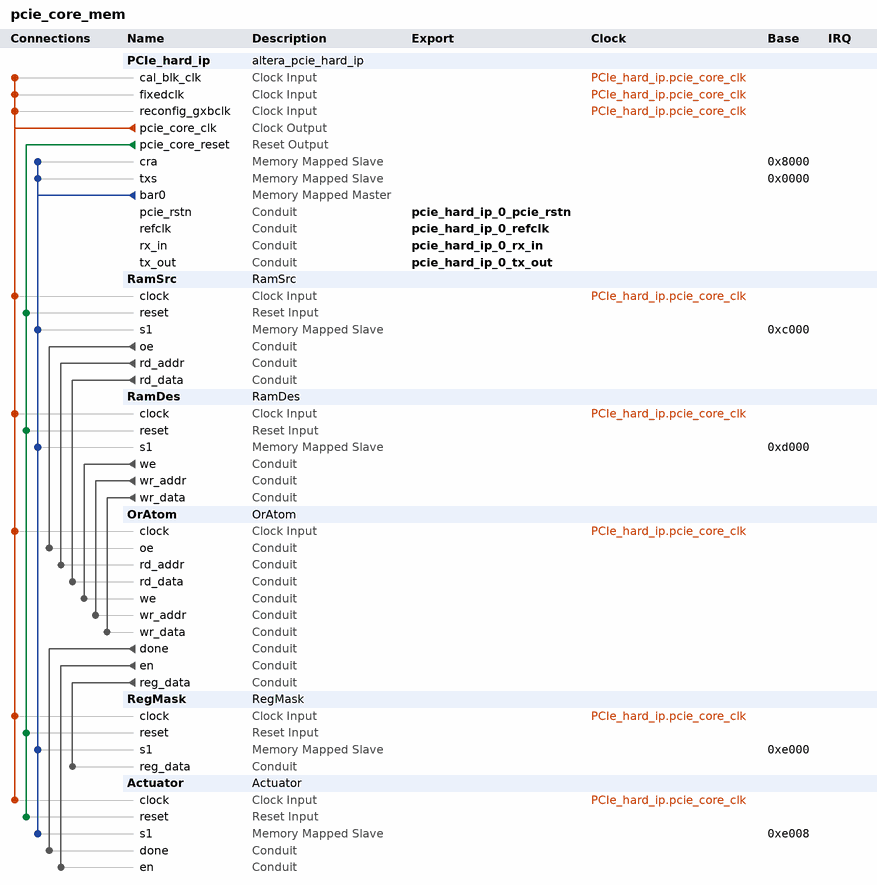
[diagram p0: system contents]
# Platform Designer (Qsys) system pcie_core_mem, Cyclone IV GX EP4CGX150DF31C8
# Parameters at their usual value, and those the tool derives, are not listed.
package require -exact qsys 17.1
create_system pcie_core_mem
set_project_property DEVICE_FAMILY {Cyclone IV GX}
set_project_property DEVICE EP4CGX150DF31C8

add_instance PCIe_hard_ip altera_pcie_hard_ip 17.1
set_instance_parameter_value PCIe_hard_ip {BAR Type} {32 bit Non-Prefetchable,Not used,Not used,Not used,Not used,Not used}
set_instance_parameter_value PCIe_hard_ip CB_A2P_ADDR_MAP_PASS_THRU_BITS 15
set_instance_parameter_value PCIe_hard_ip CG_ENABLE_A2P_INTERRUPT 0
set_instance_parameter_value PCIe_hard_ip CG_NO_CPL_REORDERING 0
set_instance_parameter_value PCIe_hard_ip {PCIe Address 31:0} 0x00000000,0x00000000,0x00000000,0x00000000,0x00000000,0x00000000,0x00000000,0x00000000,0x00000000,0x00000000,0x00000000,0x00000000,0x00000000,0x00000000,0x00000000,0x00000000
set_instance_parameter_value PCIe_hard_ip {PCIe Address 63:32} 0x00000000,0x00000000,0x00000000,0x00000000,0x00000000,0x00000000,0x00000000,0x00000000,0x00000000,0x00000000,0x00000000,0x00000000,0x00000000,0x00000000,0x00000000,0x00000000
set_instance_parameter_value PCIe_hard_ip class_code 0
set_instance_parameter_value PCIe_hard_ip device_id 4
set_instance_parameter_value PCIe_hard_ip my_advanced_errors false
set_instance_parameter_value PCIe_hard_ip my_enable_ecrc_check false
set_instance_parameter_value PCIe_hard_ip my_enable_ecrc_gen false
set_instance_parameter_value PCIe_hard_ip p_pcie_test_out_width None
set_instance_parameter_value PCIe_hard_ip p_user_msi_enable 0
set_instance_parameter_value PCIe_hard_ip subsystem_device_id 4
set_instance_parameter_value PCIe_hard_ip subsystem_vendor_id 4466
set_instance_parameter_value PCIe_hard_ip vendor_id 4466

add_instance RamSrc RamSrc 1.0
set_instance_parameter_value RamSrc B 32
set_instance_parameter_value RamSrc W 10

add_instance RamDes RamDes 1.0
set_instance_parameter_value RamDes B 32
set_instance_parameter_value RamDes W 10

add_instance OrAtom OrAtom 1.0
set_instance_parameter_value OrAtom B 32
set_instance_parameter_value OrAtom W 10

add_instance RegMask RegMask 1.0

add_instance Actuator Actuator 1.0

# connections
add_connection PCIe_hard_ip.pcie_core_clk Actuator.clock clock
add_connection PCIe_hard_ip.pcie_core_clk OrAtom.clock clock
add_connection PCIe_hard_ip.pcie_core_clk PCIe_hard_ip.cal_blk_clk clock
add_connection PCIe_hard_ip.pcie_core_clk PCIe_hard_ip.fixedclk clock
add_connection PCIe_hard_ip.pcie_core_clk PCIe_hard_ip.reconfig_gxbclk clock
add_connection PCIe_hard_ip.pcie_core_clk RamDes.clock clock
add_connection PCIe_hard_ip.pcie_core_clk RamSrc.clock clock
add_connection PCIe_hard_ip.pcie_core_clk RegMask.clock clock
add_connection PCIe_hard_ip.pcie_core_reset Actuator.reset reset
add_connection PCIe_hard_ip.pcie_core_reset RamDes.reset reset
add_connection PCIe_hard_ip.pcie_core_reset RamSrc.reset reset
add_connection PCIe_hard_ip.pcie_core_reset RegMask.reset reset
add_connection PCIe_hard_ip.bar0 Actuator.s1 avalon
set_connection_parameter_value PCIe_hard_ip.bar0/Actuator.s1 baseAddress 0xe008
add_connection PCIe_hard_ip.bar0 PCIe_hard_ip.cra avalon
set_connection_parameter_value PCIe_hard_ip.bar0/PCIe_hard_ip.cra baseAddress 0x8000
add_connection PCIe_hard_ip.bar0 PCIe_hard_ip.txs avalon
set_connection_parameter_value PCIe_hard_ip.bar0/PCIe_hard_ip.txs baseAddress 0x0000
add_connection PCIe_hard_ip.bar0 RamDes.s1 avalon
set_connection_parameter_value PCIe_hard_ip.bar0/RamDes.s1 baseAddress 0xd000
add_connection PCIe_hard_ip.bar0 RamSrc.s1 avalon
set_connection_parameter_value PCIe_hard_ip.bar0/RamSrc.s1 baseAddress 0xc000
add_connection PCIe_hard_ip.bar0 RegMask.s1 avalon
set_connection_parameter_value PCIe_hard_ip.bar0/RegMask.s1 baseAddress 0xe000
add_connection OrAtom.done Actuator.done conduit
add_connection OrAtom.en Actuator.en conduit
add_connection OrAtom.reg_data RegMask.reg_data conduit
add_connection RamDes.we OrAtom.we conduit
add_connection RamDes.wr_addr OrAtom.wr_addr conduit
add_connection RamDes.wr_data OrAtom.wr_data conduit
add_connection RamSrc.oe OrAtom.oe conduit
add_connection RamSrc.rd_addr OrAtom.rd_addr conduit
add_connection RamSrc.rd_data OrAtom.rd_data conduit

# exported interfaces
add_interface pcie_hard_ip_0_pcie_rstn conduit end
set_interface_property pcie_hard_ip_0_pcie_rstn EXPORT_OF PCIe_hard_ip.pcie_rstn
add_interface pcie_hard_ip_0_refclk conduit end
set_interface_property pcie_hard_ip_0_refclk EXPORT_OF PCIe_hard_ip.refclk
add_interface pcie_hard_ip_0_rx_in conduit end
set_interface_property pcie_hard_ip_0_rx_in EXPORT_OF PCIe_hard_ip.rx_in
add_interface pcie_hard_ip_0_tx_out conduit end
set_interface_property pcie_hard_ip_0_tx_out EXPORT_OF PCIe_hard_ip.tx_out

set_interconnect_requirement {$system} qsys_mm.clockCrossingAdapter HANDSHAKE
set_interconnect_requirement {$system} qsys_mm.enableEccProtection FALSE
set_interconnect_requirement {$system} qsys_mm.insertDefaultSlave FALSE
set_interconnect_requirement {$system} qsys_mm.maxAdditionalLatency 1

save_system pcie_core_mem.qsys
